# Altium project EE91.PrjPcb
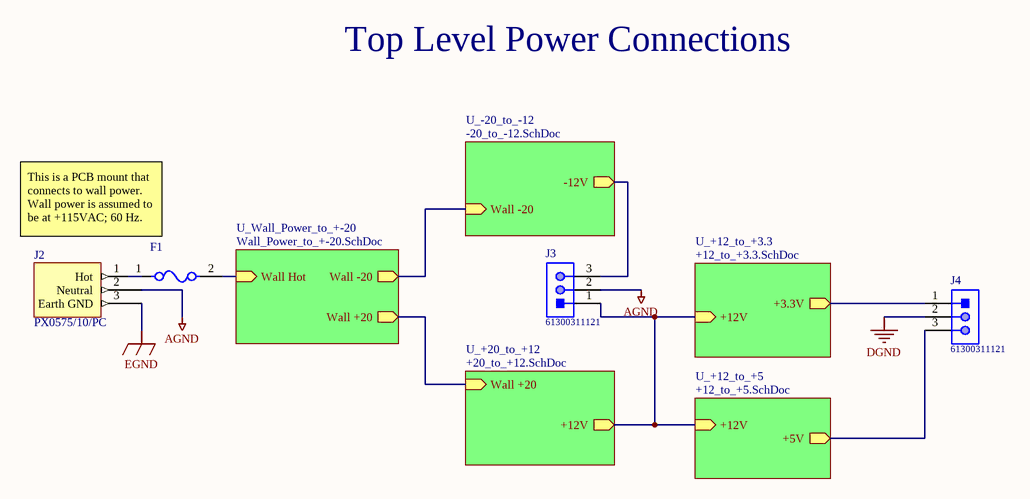
[diagram p0: Power_Connections.SchDoc]
6 sheets, 39 parts. Net scope: hierarchical (ports join the sheet entries above them; power ports are global).
Board file: EE91.PcbDoc
Sheets:
  Power_Connections.SchDoc
    U_-20_to_-12 = -20_to_-12.SchDoc
    U_Wall_Power_to_+-20 = Wall_Power_to_+-20.SchDoc
    U_+12_to_+3.3 = +12_to_+3.3.SchDoc
    U_+12_to_+5 = +12_to_+5.SchDoc
    U_+20_to_+12 = +20_to_+12.SchDoc

## Sheet Power_Connections.SchDoc
size A; SheetNumber: 1; SheetTotal: 6

### Parts
F1  C1F 3  [FP-0466-MFG]  (value not drawn)
J2  PX0575/10/PC  [PCBComponent_1]
J3  61300311121  [61300311121]
J4  61300311121  [61300311121]

### Sub-sheets
U_+12_to_+3.3 = +12_to_+3.3.SchDoc: +3.3V (out), +12V (in)
U_+12_to_+5 = +12_to_+5.SchDoc: +5V (out), +12V (in)
U_+20_to_+12 = +20_to_+12.SchDoc: Wall +20 (in), +12V (out)
U_-20_to_-12 = -20_to_-12.SchDoc: Wall -20 (in), -12V (out)
U_Wall_Power_to_+-20 = Wall_Power_to_+-20.SchDoc: Wall -20 (out), Wall +20 (out), Wall Hot (in)

### Nets
+3.3V: J4.1 ; sheet U_+12_to_+3.3/+3.3V
+5V: J4.3 ; sheet U_+12_to_+5/+5V
+12V: J3.1 ; sheet U_+12_to_+3.3/+12V, sheet U_+12_to_+5/+12V, sheet U_+20_to_+12/+12V
-12V: J3.3 ; sheet U_-20_to_-12/-12V
AGND: J2.2(Neutral) J3.2
DGND: J4.2
EGND: J2.3(Earth_GND)
NetBR1_2: sheet U_-20_to_-12/Wall -20, sheet U_Wall_Power_to_+-20/Wall -20
NetC7_1: sheet U_Wall_Power_to_+-20/Wall +20, sheet U_+20_to_+12/Wall +20
NetF1_1: F1.1 J2.1(Hot)
NetF1_2: F1.2 ; sheet U_Wall_Power_to_+-20/Wall Hot

### Notes on the sheet
- Top Level Power Connections
- This is a PCB mount that connects to wall power.  Wall power is assumed to be at +115VAC; 60 Hz.

### Library data of the parts
F1 = CMP-08605-000081-1: FUSE BOARD MNT 200MA 125VAC/VDC; Body Material: Thermoplastic; Voltage Rating: 125V; Fuse Type: Board Mount (Cartridge Style Excluded); Resistance: 1.15R; Approvals: UL; DC Cold Resistance: 1.16R; Case Code (Metric): 3216; Depth: 1.52mm; Case/Package: 1206; Lead Free: Lead Free; Length: 3.18mm; Max Operating Temperature: 90°C; Case Code (Imperial): 1206; Terminal Material: Copper; Radiation Hardening: No; Working Voltage: 125V; Packaging: Tape and Reel; Width: 0.06inch; Housing Material: Ceramic; Voltage Rating (AC): 125V; Current Rating: 200mA; Fuse Current: 200mA; Package Quantity: 5000; Height: 0.023inch; Termination: SMD/SMT; Voltage Rating (DC): 125V; Mount: Surface Mount; Min Operating Temperature: -55°C; Number of Pins: 2
J2 = CMP-002-00071-6: Conn Inlet M 3 POS 9.17mm Solder RA Thru-Hole 3 Terminal 1 Port Bulk
J3 J4 = CMP-1502-01062-1: THT Vertical Pin Header WR-PHD, Pitch 2.54 mm, Single Row, 3 pins; Manufacturer: Wurth Elektronik; Withstanding Voltage: 500VAC; Working Voltage: 250VAC; Rated Current: 3A; Pitch: 2.54mm; Pin Number: 3; Gender: Male; Contact Resistance: 20mOhm; Package Reference: 61300311121; Manufacturer URL: http://www.we-online.de; Datasheet URL: https://katalog.we-online.de/em/datasheet/6130xx11121.pdf; Operating Temperature: -40to105degC; Part Number: 61300311121; Orientation: Vertical; Packaging: Bag; Row Number: Single; Mounting Technology: THT; Publisher: WurthElektronik

## Sheet -20_to_-12.SchDoc
size A; SheetNumber: 3; SheetTotal: 6
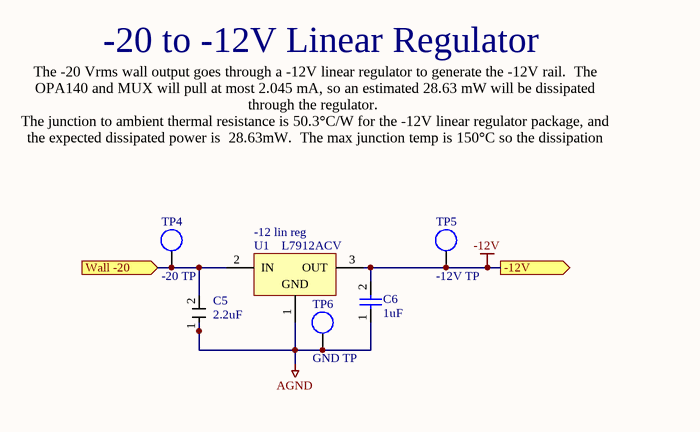
[diagram p1: -20_to_-12.SchDoc]

### Parts
C5  2.2uF  [CAPMP3216X180N]
C6  1uF  [CAPC2113X120X50LL20T30]
TP4  -20 TP  [PCBComponent_1]
TP5  -12V TP  [PCBComponent_1]
TP6  GND TP  [PCBComponent_1]
U1  L7912ACV  [TO220]

### Ports
-12V (out), Wall -20 (in)

### Nets
-12V: C6.2 TP5.TP U1.3(OUT) ; port -12V
AGND: C5.1(-) C6.1 TP6.TP U1.1(GND)
NetBR1_2: C5.2(-) TP4.TP U1.2(IN) ; port Wall -20

### Notes on the sheet
- -20 to -12V Linear Regulator
- The -20 Vrms wall output goes through a -12V linear regulator to generate the -12V rail.  The OPA140 and MUX will pull at most 2.045 mA, so an estimated 28.63 mW will be dissipated through the regulator.
  The junction to ambient thermal resistance is 50.3°C/W for the -12V linear regulator package, and the expected dissipated power is  28.63mW.  The max junction temp is 150°C so the dissipation will cause 1.44°C, acceptable for the IC.
- (near U1) -12 lin reg

### Library data of the parts
C5 = CMP-001-00083-1: Cap Tant Solid 2.2uF 35V A CASE 10% (3.2 X 1.6 X 1.6mm) SMD 3216-18 7Ohm 125°C T/R; Pin 1 is +, Pin 2 is -
C6 = CMP-2007-04033-1: Manufacturer: AVX Interconnect / Elco; Part Number: TAJR105K020RNJ
TP4-TP6 = Component_1
U1 = CMP-0244-00427-1: 2% Negative Voltage Regulator, -12V, 3-Pin TO-220; ComponentLink2Description: Datasheet; PackageReference: TO220; ComponentLink1Description: Manufacturer URL; DatasheetVersion: 1/11/2010; ComponentLink2URL: http://www.st.com/internet/com/TECHNICAL_RESOURCES/TECHNICAL_LITERATURE/DATASHEET/CD00000451.pdf; PackageVersion: ver3.0; ComponentLink3Description: Package Specification; PackageDescription: TO, Thru-Hole, Vertical, Heatsink Mounted; 3 In-Line Leads; Pitch 2.54 mm; ComponentLink3URL: http://www.st.com/internet/com/TECHNICAL_RESOURCES/TECHNICAL_LITERATURE/PACKAGE_INFORMATION/CD00004649.pdf; ComponentLink1URL: http://www.st.com

## Sheet Wall_Power_to_+-20.SchDoc
size A; SheetNumber: 2; SheetTotal: 6
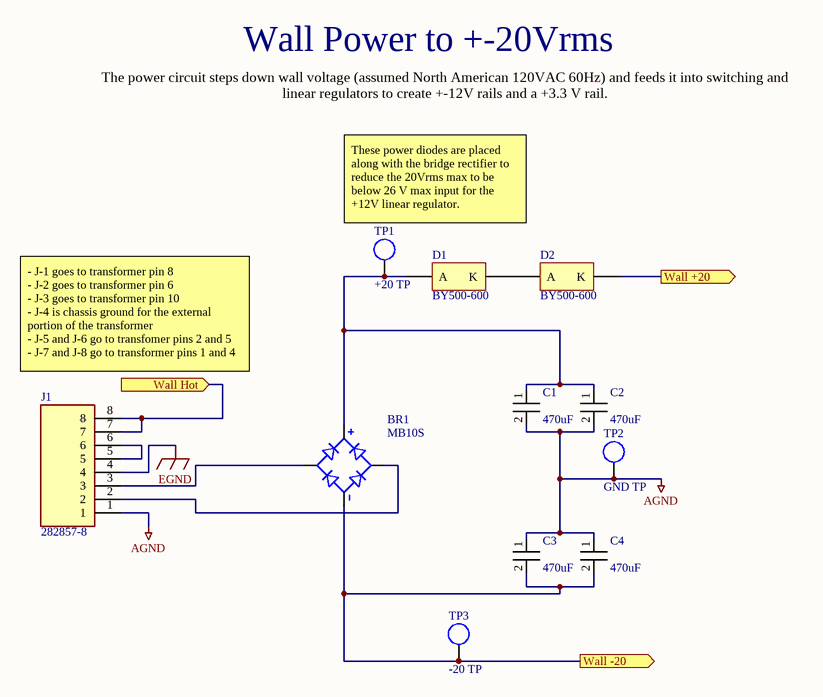
[diagram p2: Wall_Power_to_+-20.SchDoc]

### Parts
BR1  MB10S  [SOIC245P670X290-4N]
C1  470uF  [PCBComponent_1]
C2  470uF  [PCBComponent_1]
C3  470uF  [PCBComponent_1]
C4  470uF  [PCBComponent_1]
D1  BY500-600  [ONSC-AXIAL_LEAD-2-267-05_V]
D2  BY500-600  [ONSC-AXIAL_LEAD-2-267-05_V]
J1  282857-8  [282857-8-Footprint-1]
TP1  +20 TP  [PCBComponent_1]
TP2  GND TP  [PCBComponent_1]
TP3  -20 TP  [PCBComponent_1]

### Ports
Wall +20 (out), Wall -20 (out), Wall Hot (in)

### Nets
AGND: C1.2(-) C2.2(-) C3.1(+) C4.1(+) J1.1 TP2.TP
EGND: J1.4
NetBR1_1: BR1.1(POS) C1.1(+) C2.1(+) D1.2(A) TP1.TP
NetBR1_2: BR1.2(NEG) C3.2(-) C4.2(-) TP3.TP ; port Wall -20
NetBR1_3: BR1.3(AC2) J1.3
NetBR1_4: BR1.4(AC1) J1.2
NetC7_1: D2.1(K) ; port Wall +20
NetD1_1: D1.1(K) D2.2(A)
NetF1_2: J1.7 J1.8 ; port Wall Hot
NetJ1_5: J1.5 J1.6

### Notes on the sheet
- Wall Power to +-20Vrms
- The power circuit steps down wall voltage (assumed North American 120VAC 60Hz) and feeds it into switching and linear regulators to create +-12V rails and a +3.3 V rail.
- These power diodes are placed along with the bridge rectifier to reduce the 20Vrms max to be below 26 V max input for the +12V linear regulator.
- (near J1) - J-1 goes to transformer pin 8
  - J-2 goes to transformer pin 6
  - J-3 goes to transformer pin 10
  - J-4 is chassis ground for the external portion of the transformer
  - J-5 and J-6 go to transfomer pins 2 and 5
  - J-7 and J-8 go to transformer pins 1 and 4

### Library data of the parts
BR1 = MB10S: Bridge Rectifier Single Phase Standard 1kV Surface Mount 4-SOIC; MF: ON Semiconductor; MP: MB10S; Package: SOIC-4 ON Semiconductor; Digi-Key_Purchase_URL: https://www.digikey.com/product-detail/en/on-semiconductor/MB10S/MB10SCT-ND/2444921?utm_source=snapeda&utm_medium=aggregator&utm_campaign=symbol; Digi-Key_Part_Number: MB10SCT-ND; SnapEDA_Link: https://www.snapeda.com/parts/MB10S/ON%20Semiconductor/view-part/1686091/?ref=snap; Value: *
C1-C4 = UPS1H471MPD-4: 470uF Joe Knows Electronics Capacitor Footprint.   13x20 mm diameter and length, Leads are 0.6mm, 5mm dist between leads, 4mm from edge
D1 D2 = CMP-1055-00010-1: Rectifier, 2-Pin Axial_Lead, Pb-Free, Tape and Reel; Manufacturer: On Semiconductor; PartNumber: 1N5822RLG; Configuration: Single; IFSM Max (A): 80; ComponentLink2URL: http://www.onsemi.cn/pub_link/Collateral/1N5820-D.PDF; Packing: Tape and Reel; ComponentLink1Description: Manufacturer URL; PackageDescription: 2-Pin, Axial Lead, Diameter 5.05 mm; ComponentLink3Description: Package Specification; PackageReference: AXIAL_LEAD-2-267-05; PackageVersion: Rev. G, 06/2000; ComponentLink1URL: http://www.onsemi.com/; ComponentLink2Description: Datasheet; RoHS: TRUE; Mounting Technology: Through Hole; DatasheetVersion: Rev. 10; ComponentLink3URL: http://www.onsemi.com/pub_link/Collateral/267-05.PDF
J1 = CMP-002-00073-1: Conn Eurostyle Block HDR 8 POS 5.08mm Solder ST Thru-Hole 24A Carton
TP1-TP3 = Component_1

## Sheet +12_to_+3.3.SchDoc
size A; SheetNumber: 6; SheetTotal: 6
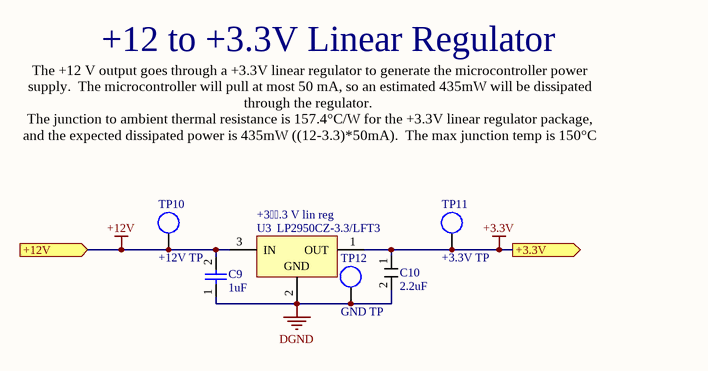
[diagram p3: +12_to_+3.3.SchDoc]

### Parts
C9  1uF  [CAPC2113X120X50LL20T30]
C10  2.2uF  [CAPMP3216X180N]
TP10  +12V TP  [PCBComponent_1]
TP11  +3.3V TP  [PCBComponent_1]
TP12  GND TP  [PCBComponent_1]
U3  LP2950CZ-3.3/LFT3  [LP0003A]

### Ports
+3.3V (out), +12V (in)

### Nets
+3.3V: C10.1(-) TP11.TP U3.1(OUT) ; port +3.3V
+12V: C9.2 TP10.TP U3.3(IN) ; port +12V
DGND: C9.1 C10.2(-) TP12.TP U3.2(GND)

### Notes on the sheet
- +12 to +3.3V Linear Regulator
- The +12 V output goes through a +3.3V linear regulator to generate the microcontroller power supply.  The microcontroller will pull at most 50 mA, so an estimated 435mW will be dissipated through the regulator.
  The junction to ambient thermal resistance is 157.4°C/W for the +3.3V linear regulator package, and the expected dissipated power is 435mW ((12-3.3)*50mA).  The max junction temp is 150°C so the dissipation will cause ~68°C, acceptable for the IC.
- (near U3) +3.3 V lin reg

### Library data of the parts
C9 = CMP-2007-04033-1: as C6 on sheet -20_to_-12
C10 = CMP-001-00083-1: as C5 on sheet -20_to_-12
TP10-TP12 = Component_1
U3 = CMP-0062-00052-3: Series of Adjustable Micropower Voltage Regulators, 3-pin TO-92, Pb-Free; Manufacturer: Texas Instruments; CompType: LDO IC; PowerWise: N; PackageTopMarking: NSXYTT*2950*CZ3.3; Code_JEDEC: TO-226-AA; PinCount: 3; RoHS: Y; ComponentLink1Description: Datasheet URL; PackageDescription: TO-92, Molded, 3 Lead; ComponentLink1URL: http://www.ti.com/general/docs/lit/getliterature.tsp?genericPartNumber=LP2950-N&fileType=pdf; PackageReference: LP0003A

## Sheet +12_to_+5.SchDoc
size A; SheetNumber: 5; SheetTotal: 6
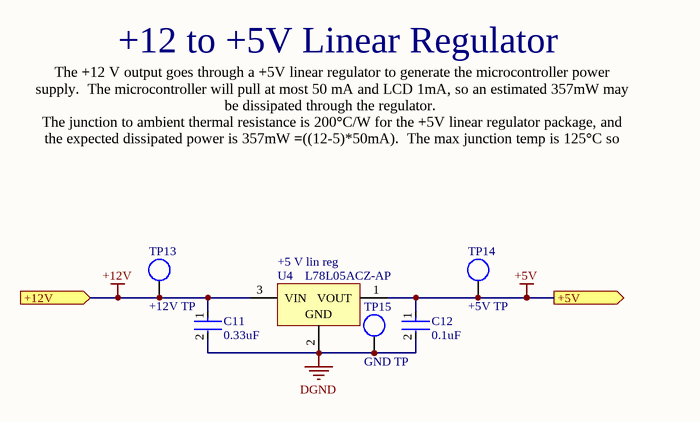
[diagram p4: +12_to_+5.SchDoc]

### Parts
C11  0.33uF  [FP-C0805C-DG-MFG]
C12  0.1uF  [FP-C0805C-DG-MFG]
TP13  +12V TP  [PCBComponent_1]
TP14  +5V TP  [PCBComponent_1]
TP15  GND TP  [PCBComponent_1]
U4  L78L05ACZ-AP  [TO-92]

### Ports
+5V (out), +12V (in)

### Nets
+5V: C12.1 TP14.TP U4.1(VOUT) ; port +5V
+12V: C11.1 TP13.TP U4.3(VIN) ; port +12V
DGND: C11.2 C12.2 TP15.TP U4.2(GND)

### Notes on the sheet
- +12 to +5V Linear Regulator
- The +12 V output goes through a +5V linear regulator to generate the microcontroller power supply.  The microcontroller will pull at most 50 mA and LCD 1mA, so an estimated 357mW may be dissipated through the regulator.
  The junction to ambient thermal resistance is 200°C/W for the +5V linear regulator package, and the expected dissipated power is 357mW =((12-5)*50mA).  The max junction temp is 125°C so the dissipation will cause 71.4°C, acceptable for the IC.
- (near U4) +5 V lin reg

### Library data of the parts
C11 C12 = CMP-2007-03243-2: CAP CER 10UF 10V X5R 0805; Manufacturer Part Number: C0805C106K8PACTU; Manufacturer: Kemet; 3DS Part Number: 220-00001; Tolerance: 10%; Temperature Coefficient: 15%; Material: Ceramic; Device Class L2: Capacitors; Device Class L1: Passive Components; ComponentLink2URL: https://content.kemet.com/datasheets/KEM_C1006_X5R_SMD.pdf; Height: 1.4mm; Lead Free: Yes; Digikey Description: CAP CER 10UF 10V X5R 0805; Octopart: https://octopart.com/c0805c106k8pactu-kemet-98697; Capacitance: 10uF; Value: 10uF; Temperature Range Low: -55°C; Temperature: -55°C to +85°C; Automotive: No; Mouser Description: CAP CER 10UF 10V X5R 0805; Ipc Land Pattern Name: CAPC200125X125; Temperature Range High: +85°C; Voltage: 10V; RoHS: TRUE; Device Class L3: Ceramic Capacitors; ComponentLink2Description: Datasheet; Voltage Rating: 10V; Package: C0805C-DG; Temperature Characteristic: X5R; Category: Cap
TP13-TP15 = Component_1
U4 = CMP-0244-00019-1: Positive Voltage Regulator, 5V, 3-Pin TO-92; DatasheetVersion: 1/02/2011; ComponentLink1URL: http://www.st.com; PackageDescription: TO, Flat Index; 3 In-Line, Axial Leads; Body Dia. 4.7mm; Lead Dia. 0.56 mm (max); PackageReference: TO-92; ComponentLink2Description: Datasheet; ComponentLink2URL: http://www.st.com/internet/com/TECHNICAL_RESOURCES/TECHNICAL_LITERATURE/DATASHEET/CD00000446.pdf; ComponentLink1Description: Manufacturer URL; PackageVersion: 2011

## Sheet +20_to_+12.SchDoc
size A; SheetNumber: 4; SheetTotal: 6
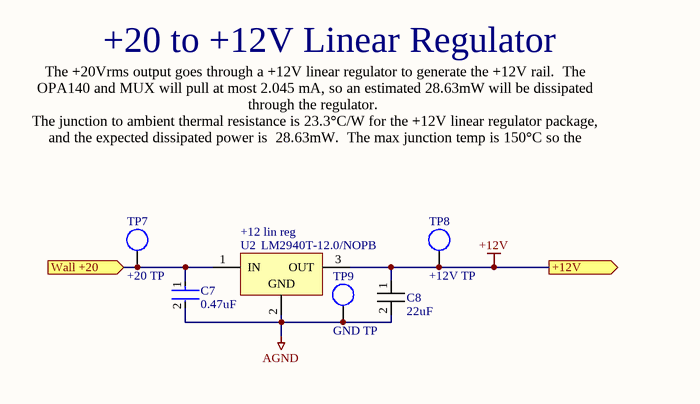
[diagram p5: +20_to_+12.SchDoc]

### Parts
C7  0.47uF  [FP-C0805C-DG-MFG]
C8  22uF  [CAPPRD200W50D550H1250]
TP7  +20 TP  [PCBComponent_1]
TP8  +12V TP  [PCBComponent_1]
TP9  GND TP  [PCBComponent_1]
U2  LM2940T-12.0/NOPB  [NDE0003A]

### Ports
+12V (out), Wall +20 (in)

### Nets
+12V: C8.1(+) TP8.TP U2.3(OUT) ; port +12V
AGND: C7.2 C8.2(-) TP9.TP U2.2(GND)
NetC7_1: C7.1 TP7.TP U2.1(IN) ; port Wall +20

### Notes on the sheet
- +20 to +12V Linear Regulator
- The +20Vrms output goes through a +12V linear regulator to generate the +12V rail.  The OPA140 and MUX will pull at most 2.045 mA, so an estimated 28.63mW will be dissipated through the regulator.
  The junction to ambient thermal resistance is 23.3°C/W for the +12V linear regulator package, and the expected dissipated power is  28.63mW.  The max junction temp is 150°C so the dissipation will cause 0.667°C, acceptable for the IC.
- (near U2) +12 lin reg

### Library data of the parts
C7 = CMP-2007-03243-2: as C11 on sheet +12_to_+5; Device Class L2: Capacitors; Device Class L1: Passive Components; ComponentLink2URL: https://content.kemet.com/datasheets/KEM_C1006_X5R_SMD.pdf; Height: 1.4mm; Lead Free: Yes; Digikey Description: CAP CER 10UF 10V X5R 0805; Octopart: https://octopart.com/c0805c106k8pactu-kemet-98697; Capacitance: 10uF; Value: 10uF; Temperature Range Low: -55°C; Temperature: -55°C to +85°C; Automotive: No; Mouser Description: CAP CER 10UF 10V X5R 0805; Ipc Land Pattern Name: CAPC200125X125; Temperature Range High: +85°C; Voltage: 10V; RoHS: TRUE; Device Class L3: Ceramic Capacitors; ComponentLink2Description: Datasheet; Voltage Rating: 10V; Package: C0805C-DG; Temperature Characteristic: X5R; Category: Cap
C8 = 860010572003-3: Wurth Elektronik 22 µF 35 V Aluminum Electrolytic Capacitors Radial, Can - 2000 Hrs @ 85°C; Pin 1 is +, Pin 2 is -
TP7-TP9 = Component_1
U2 = CMP-0062-02521-3: 1A Low Dropout Regulator, 3-pin TO-220, Pb-Free; Manufacturer: Texas Instruments; PowerWise: N; CompType: LDO IC; PackageTopMarking: NSUZXYTTE#*LM2940T*12.0 P+; PackageDescription: TO-220, Molded, 3 Lead, Straight; PinCount: 3; RoHS: Y; PackageReference: NDE0003A; ComponentLink1URL: http://www.ti.com/general/docs/lit/getliterature.tsp?genericPartNumber=LM2940-N&fileType=pdf; ComponentLink1Description: Datasheet URL

## Nets that join several sheets
+3.3V: Power_Connections (J4.1), +12_to_+3.3 (C10.1 TP11.TP U3.1)
+5V: Power_Connections (J4.3), +12_to_+5 (C12.1 TP14.TP U4.1)
+12V: Power_Connections (J3.1), +12_to_+3.3 (C9.2 TP10.TP U3.3), +12_to_+5 (C11.1 TP13.TP U4.3), +20_to_+12 (C8.1 TP8.TP U2.3)
-12V: Power_Connections (J3.3), -20_to_-12 (C6.2 TP5.TP U1.3)
AGND: Power_Connections (J2.2 J3.2), -20_to_-12 (C5.1 C6.1 TP6.TP U1.1), Wall_Power_to_+-20 (6 pins), +20_to_+12 (C7.2 C8.2 TP9.TP U2.2)
DGND: Power_Connections (J4.2), +12_to_+3.3 (C9.1 C10.2 TP12.TP U3.2), +12_to_+5 (C11.2 C12.2 TP15.TP U4.2)
EGND: Power_Connections (J2.3), Wall_Power_to_+-20 (J1.4)
NetBR1_2: -20_to_-12 (C5.2 TP4.TP U1.2), Wall_Power_to_+-20 (BR1.2 C3.2 C4.2 TP3.TP)
NetC7_1: Wall_Power_to_+-20 (D2.1), +20_to_+12 (C7.1 TP7.TP U2.1)
NetF1_2: Power_Connections (F1.2), Wall_Power_to_+-20 (J1.7 J1.8)